# EAGLE schematic Motorbike monitoring and Alarm (EAGLE 9.5.1)
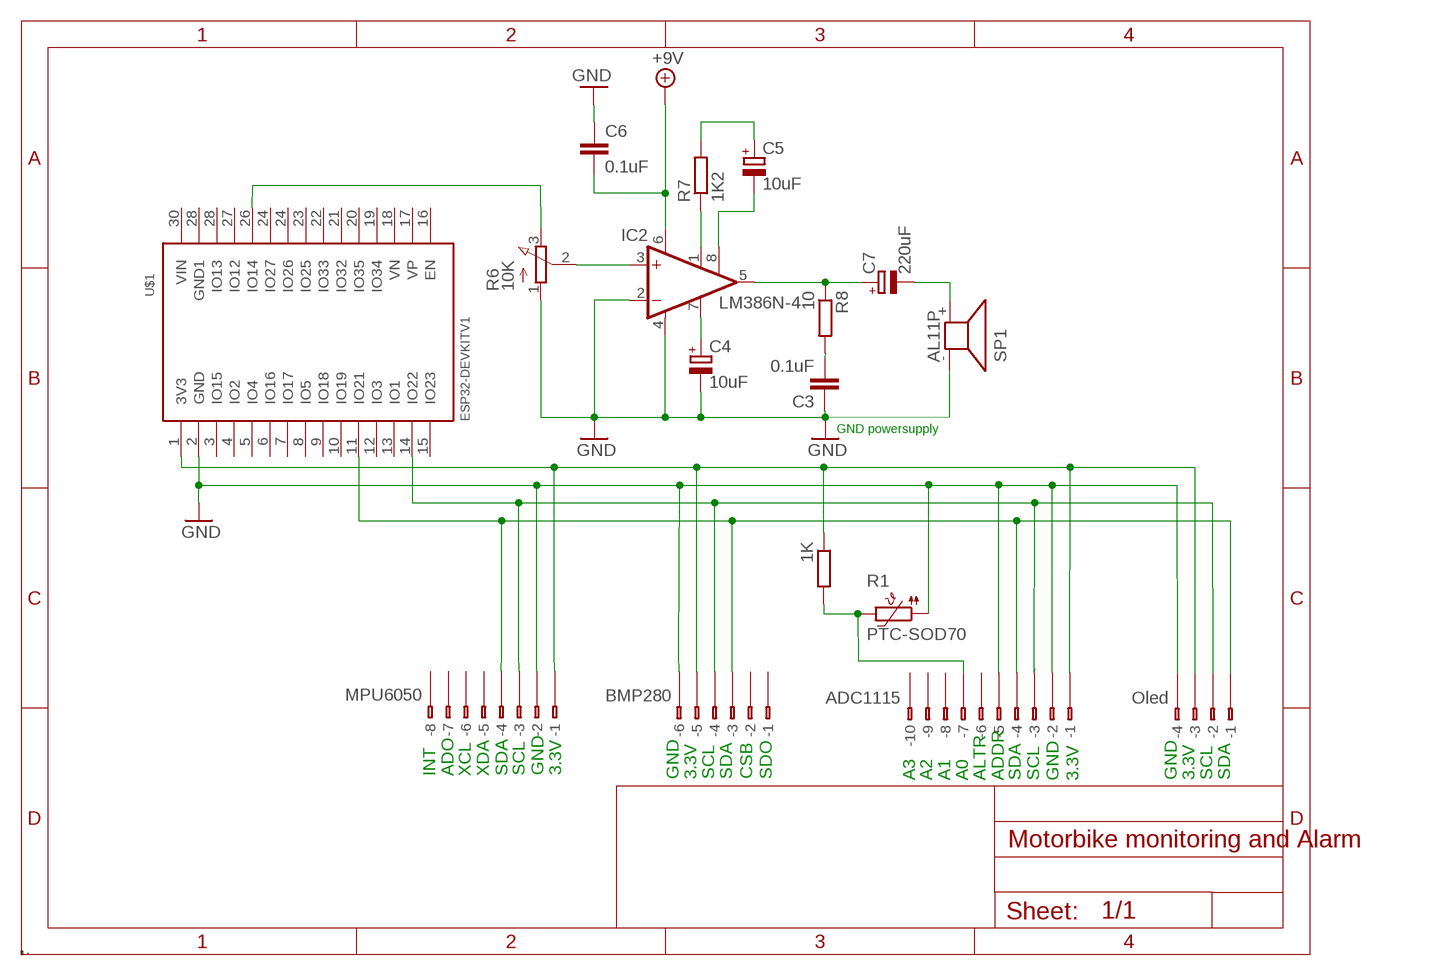
[diagram p0: schematic, sheet 1]

## Parts
ADC1115  233-110  [233-110]
C3  0.1uF  C-EU050-024X044  [C050-024X044]
C4  10uF  CPOL-EUE1.8-4  [E1,8-4]
C5  10uF  CPOL-EUE1.8-4  [E1,8-4]
C6  0.1uF  C-EU050-024X044  [C050-024X044]
C7  220uF  CPOL-EUE1.8-4  [E1,8-4]
IC2  LM386N-4  [DIL08]
MPU6050  233-108  [233-108]
R1  PTC-SOD70  [SOD70]
R2  1K  R-EU_0207/7  [0207/7]
R6  10K  3RP/1610N  [3RP/1610N]
R7  1K2  R-EU_0207/7  [0207/7]
R8  10  R-EU_0207/7  [0207/7]
SP1  AL11P  [AL11P]
U$1  ESP32DEVKITV1  [ESP32-DEVKITV1]
X1  Oled  233-104  [233-104]
X5  BMP280  233-106  [233-106]

## Nets
+9V: C6.2 IC2.6(VS)
GND: ADC1115.B2(B-2) MPU6050.B2(B-2) U$1.2(GND) X1.B4(B-4) X5.B6(B-6)
N$1: ADC1115.B1(B-1) MPU6050.B1(B-1) R2.1 U$1.1(3V3) X1.B3(B-3) X5.B5(B-5)
N$2: R6.3(E) U$1.26(IO14)
N$3: C6.1
N$5: C3.1 C4.- IC2.2(-IN) IC2.4(GND) R6.1(A) SP1.-
N$6: IC2.3(+IN) R6.2(S)
N$7: IC2.1(GAIN) R7.1
N$8: C5.- IC2.8(GAIN)
N$9: C5.+ R7.2
N$10: C4.+ IC2.7(BYPASS)
N$11: C7.+ IC2.5(OUT) R8.1
N$12: C3.2 R8.2
N$13: C7.- SP1.+
N$14: ADC1115.B7(B-7) R1.2 R2.2
N$15: ADC1115.B3(B-3) MPU6050.B3(B-3) U$1.14(IO22) X1.B2(B-2) X5.B4(B-4)
N$16: R1.1
N$17: ADC1115.B5(B-5)
N$18: ADC1115.B4(B-4) MPU6050.B4(B-4) U$1.11(IO21) X1.B1(B-1) X5.B3(B-3)
Unconnected: ADC1115.A1(-1) ADC1115.A2(-2) ADC1115.A3(-3) ADC1115.A4(-4) ADC1115.A5(-5) ADC1115.A6(-6) ADC1115.A7(-7) ADC1115.A8(-8) ADC1115.A9(-9) ADC1115.A10(-10) ADC1115.B6(B-6) ADC1115.B8(B-8) ADC1115.B9(B-9) ADC1115.B10(B-10) MPU6050.A1(-1) MPU6050.A2(-2) MPU6050.A3(-3) MPU6050.A4(-4) MPU6050.A5(-5) MPU6050.A6(-6) MPU6050.A7(-7) MPU6050.A8(-8) MPU6050.B5(B-5) MPU6050.B6(B-6) MPU6050.B7(B-7) MPU6050.B8(B-8) U$1.3(IO15) U$1.4(IO2) U$1.5(IO4) U$1.6(IO16) U$1.7(IO17) U$1.8(IO5) U$1.9(IO18) U$1.10(IO19) U$1.12(IO3) U$1.13(IO1) U$1.15(IO23) U$1.16(EN) U$1.17(VP) U$1.18(VN) U$1.19(IO34) U$1.20(IO35) U$1.21(IO32) U$1.22(IO33) U$1.23(IO25) U$1.24(IO26) U$1.24(IO27) U$1.27(IO12) U$1.28(GND1) U$1.28(IO13) U$1.30(VIN) X1.A1(-1) X1.A2(-2) X1.A3(-3) X1.A4(-4) X5.A1(-1) X5.A2(-2) X5.A3(-3) X5.A4(-4) X5.A5(-5) X5.A6(-6) X5.B1(B-1) X5.B2(B-2)

## Notes on the sheet
- GND powersupply
- INT | ADO | XCL | XDA | SDA | SCL | GND | 3.3V | GND | 3.3V | SCL | SDA | CSB | SDO | GND | 3.3V | SCL | SDA
- A3 | A2 | A1 | A0 | ALTR | ADDR | SDA | SCL | GND | 3.3V

## Library data of the parts
ADC1115 = con-wago:233-110: WAGO Cage Clamp; MPN: 233-110; OC_FARNELL: unknown; OC_NEWARK: 28K9052
C3 C6 = rcl:C-EU: CAPACITOR, European symbol; SPICEPREFIX: C
C4 C5 C7 = rcl:CPOL-EU: POLARIZED CAPACITOR, European symbol; SPICEPREFIX: C
IC2 = linear:LM386?-*: Low Voltage Audio Power Amplifier Source: http://cache.national.com/ds/LM/LM386.pdf
MPU6050 = con-wago:233-108: WAGO Cage Clamp; MPN: 233-108; OC_FARNELL: unknown; OC_NEWARK: 28K9050
R1 = ptc-ntc:PTC-: Positive Temperature Coefficient Resistor (PTC) termistor Philips KTY81-210 - KTY81-252 Source: 153627-da-01-en-Temperatur-Sensor_KTY10-6_Philips.pdf; OC_FARNELL: unknown; OC_NEWARK: unknown
R2 R7 R8 = rcl:R-EU_: RESISTOR, European symbol; SPICEPREFIX: R
R6 = pot:3RP/1610N: 16mm Potentiometer one level Source: http://www.alphapotentiometers.net/html/16mm_pot_2.html
SP1 = buzzer:AL11P: SPEAKER Source: Buerklin; OC_FARNELL: unknown; OC_NEWARK: unknown
U$1 = ESP32-DEVKITV1:ESP32DEVKITV1
X1 = con-wago:233-104: WAGO Cage Clamp; MPN: 233-104; OC_FARNELL: unknown; OC_NEWARK: 28K9046
X5 = con-wago:233-106: WAGO Cage Clamp; MPN: 233-106; OC_FARNELL: unknown; OC_NEWARK: 28K9048